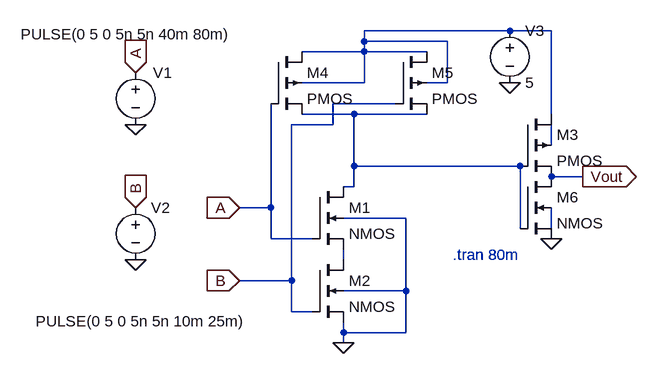
[diagram p0: schematic and gate.asc]
and gate.asc, the LTspice schematic file:
Version 4.1
SHEET 1 880 680
WIRE 48 -2848 -176 -2848
WIRE 112 -2848 48 -2848
WIRE -176 -2832 -176 -2848
WIRE -48 -2832 -176 -2832
WIRE -176 -2816 -176 -2832
WIRE -176 -2816 -272 -2816
WIRE -80 -2816 -176 -2816
WIRE -176 -2768 -176 -2816
WIRE -176 -2768 -272 -2768
WIRE -48 -2768 -48 -2832
WIRE -48 -2768 -80 -2768
WIRE -128 -2736 -224 -2736
WIRE -192 -2720 -272 -2720
WIRE -80 -2720 -192 -2720
WIRE 112 -2720 112 -2848
WIRE -224 -2704 -224 -2736
WIRE -224 -2704 -288 -2704
WIRE 112 -2672 112 -2704
WIRE -192 -2640 -192 -2720
WIRE 64 -2640 -192 -2640
WIRE 160 -2624 112 -2624
WIRE -192 -2608 -192 -2640
WIRE -192 -2608 -208 -2608
WIRE -320 -2576 -320 -2736
WIRE -320 -2576 -368 -2576
WIRE -112 -2560 -208 -2560
WIRE 64 -2544 64 -2640
WIRE 112 -2544 112 -2576
WIRE -320 -2528 -320 -2576
WIRE -256 -2528 -320 -2528
WIRE -208 -2496 -208 -2512
WIRE -288 -2464 -288 -2704
WIRE -288 -2464 -368 -2464
WIRE -112 -2448 -112 -2560
WIRE -112 -2448 -208 -2448
WIRE -288 -2416 -288 -2464
WIRE -256 -2416 -288 -2416
WIRE -208 -2384 -208 -2400
WIRE -112 -2384 -112 -2448
WIRE -112 -2384 -208 -2384
WIRE -208 -2368 -208 -2384
FLAG -208 -2368 0
FLAG -528 -2576 B
IOPIN -528 -2576 In
FLAG -368 -2464 B
IOPIN -368 -2464 In
FLAG -528 -2784 A
IOPIN -528 -2784 In
FLAG -368 -2576 A
IOPIN -368 -2576 In
FLAG -528 -2496 0
FLAG -528 -2704 0
FLAG 48 -2768 0
FLAG 112 -2528 0
FLAG 160 -2624 Vout
IOPIN 160 -2624 Out
SYMBOL pmos4 -320 -2816 R0
SYMATTR InstName M4
SYMBOL pmos4 -128 -2816 R0
SYMATTR InstName M5
SYMBOL nmos4 -256 -2608 R0
SYMATTR InstName M1
SYMBOL nmos4 -256 -2496 R0
SYMATTR InstName M2
SYMBOL voltage -528 -2800 R0
WINDOW 0 56 16 Right 2
WINDOW 3 -177 -43 Left 2
WINDOW 123 0 0 Left 0
WINDOW 39 0 0 Left 0
SYMATTR InstName V1
SYMATTR Value PULSE(0 5 0 5n 5n 40m 80m)
SYMBOL voltage -528 -2592 R0
WINDOW 3 -154 191 Left 2
WINDOW 123 0 0 Left 0
WINDOW 39 0 0 Left 0
SYMATTR Value PULSE(0 5 0 5n 5n 10m 25m)
SYMATTR InstName V2
SYMBOL voltage 48 -2864 R0
WINDOW 123 0 0 Left 0
WINDOW 39 0 0 Left 0
SYMATTR InstName V3
SYMATTR Value 5
SYMBOL pmos4 64 -2720 R0
SYMATTR InstName M3
SYMBOL nmos4 64 -2624 R0
SYMATTR InstName M6
TEXT -40 -2504 Left 2 !.tran 80m
TEXT -40 -2504 Left 2 ;.tran 80m
TEXT -40 -2504 Left 2 ;.tran 80m
TEXT -40 -2504 Left 2 ;.tran 80m

The netlist it stands for:
* and gate.asc
M4 N001 A N002 N001 PMOS
M5 N001 B N002 N001 PMOS
M1 N002 A N005 0 NMOS
M2 N005 B 0 0 NMOS
V1 A 0 PULSE(0 5 0 5n 5n 40m 80m)
V2 B 0 PULSE(0 5 0 5n 5n 10m 25m)
V3 N001 0 5
M3 N001 N002 Vout N003 PMOS
M6 Vout N002 0 N004 NMOS
.model NMOS NMOS
.model PMOS PMOS
.lib standard.mos
.tran 80m
* .tran 80m
* .tran 80m
* .tran 80m
.backanno
.end